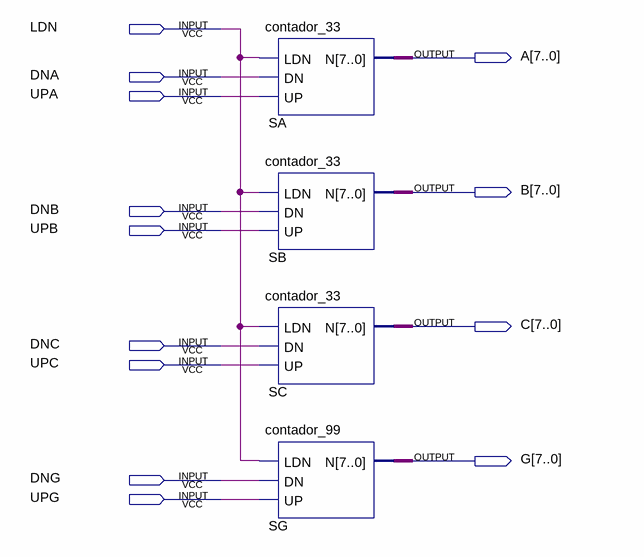
[diagram p0: schematic sheet]
// Quartus schematic modulo_contador.bdf as structural Verilog: 4 symbols, 13 pins
module modulo_contador (
  input  LDN,
  input  DNA,
  input  UPA,
  input  DNB,
  input  UPB,
  input  DNC,
  input  UPC,
  input  DNG,
  input  UPG,
  output [7:0] A,
  output [7:0] B,
  output [7:0] C,
  output [7:0] G
);

  contador_33 SA (.LDN(LDN), .DN(DNA), .UP(UPA), .N(A));
  contador_33 SB (.LDN(LDN), .DN(DNB), .UP(UPB), .N(B));
  contador_33 SC (.LDN(LDN), .DN(DNC), .UP(UPC), .N(C));
  contador_99 SG (.LDN(LDN), .DN(DNG), .UP(UPG), .N(G));
endmodule
